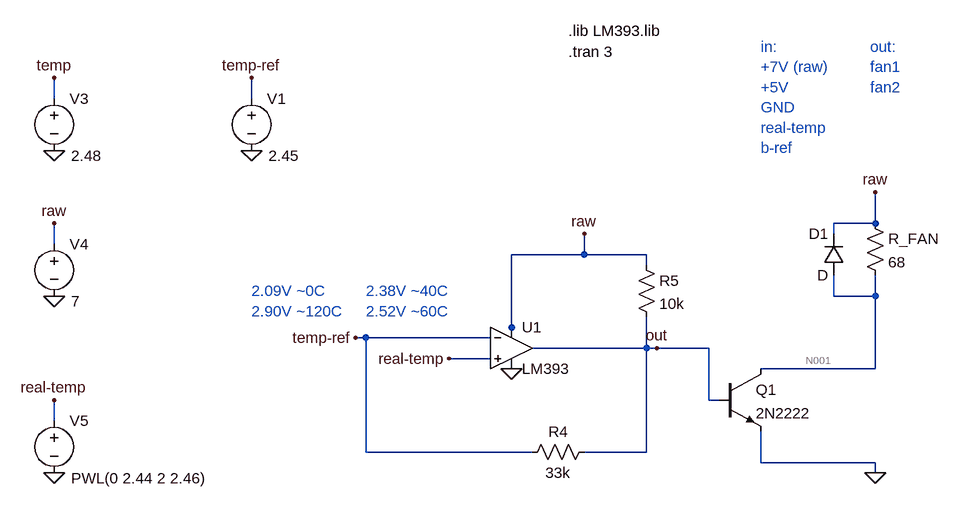
[diagram p0: schematic fan3.asc]
fan3.asc, the LTspice schematic file:
Version 4
SHEET 1 880 680
WIRE -608 -288 -608 -320
WIRE -304 -288 -304 -320
WIRE 656 -96 656 -144
WIRE 656 -96 592 -96
WIRE 592 -80 592 -96
WIRE -608 -64 -608 -96
WIRE 208 -48 208 -80
WIRE 208 -48 96 -48
WIRE 304 -48 208 -48
WIRE 304 -32 304 -48
WIRE 592 16 592 -16
WIRE 656 16 656 -16
WIRE 656 16 592 16
WIRE 96 64 96 -48
WIRE -128 80 -144 80
WIRE 64 80 -128 80
WIRE 96 80 96 64
WIRE 304 96 304 48
WIRE 304 96 128 96
WIRE 320 96 304 96
WIRE 400 96 320 96
WIRE 64 112 0 112
WIRE 656 128 656 16
WIRE 656 128 480 128
WIRE 400 176 400 96
WIRE 416 176 400 176
WIRE -608 208 -608 176
WIRE -128 256 -128 80
WIRE 128 256 -128 256
WIRE 304 256 304 96
WIRE 304 256 208 256
WIRE 480 272 480 224
WIRE 656 272 480 272
WIRE 656 288 656 272
FLAG 96 128 0
FLAG -304 -208 0
FLAG -304 -320 temp-ref
FLAG -144 80 temp-ref
FLAG 656 288 0
FLAG 656 -144 raw
FLAG -608 -208 0
FLAG -608 -320 temp
FLAG -608 16 0
FLAG -608 -96 raw
FLAG -608 288 0
FLAG -608 176 real-temp
FLAG 320 96 out
FLAG 208 -80 raw
FLAG 0 112 real-temp
SYMBOL OpAmps\\opamp2 96 32 R0
SYMATTR InstName U1
SYMATTR Value LM393
SYMBOL res 224 240 R90
WINDOW 0 0 56 VBottom 2
WINDOW 3 32 56 VTop 2
SYMATTR InstName R4
SYMATTR Value 33k
SYMBOL voltage -304 -304 R0
WINDOW 3 26 104 Left 2
WINDOW 123 0 0 Left 0
WINDOW 39 0 0 Left 0
SYMATTR Value 2.45
SYMATTR InstName V1
SYMBOL res 288 -48 R0
SYMATTR InstName R5
SYMATTR Value 10k
SYMBOL res 640 -112 R0
SYMATTR InstName R_FAN
SYMATTR Value 68
SYMBOL diode 608 -16 R180
WINDOW 0 24 64 Left 2
WINDOW 3 24 0 Left 2
SYMATTR InstName D1
SYMBOL voltage -608 -304 R0
WINDOW 3 26 104 Left 2
WINDOW 123 0 0 Left 0
WINDOW 39 0 0 Left 0
SYMATTR Value 2.48
SYMATTR InstName V3
SYMBOL voltage -608 -80 R0
WINDOW 3 26 104 Left 2
WINDOW 123 0 0 Left 0
WINDOW 39 0 0 Left 0
SYMATTR Value 7
SYMATTR InstName V4
SYMBOL voltage -608 192 R0
WINDOW 3 26 104 Left 2
WINDOW 123 0 0 Left 0
WINDOW 39 0 0 Left 0
SYMATTR Value PWL(0 2.44 2 2.46)
SYMATTR InstName V5
SYMBOL npn 416 128 R0
SYMATTR InstName Q1
SYMATTR Value 2N2222
TEXT 184 -360 Left 2 !.tran 3
TEXT 184 -392 Left 2 !.lib LM393.lib
TEXT -304 8 Left 2 ;2.09V ~0C\n2.90V ~120C
TEXT -128 8 Left 2 ;2.38V ~40C\n2.52V ~60C
TEXT 480 -368 Left 2 ;in:\n+7V (raw)\n+5V\nGND\nreal-temp\nb-ref
TEXT 648 -368 Left 2 ;out:\nfan1\nfan2

The netlist it stands for:
* fan3.asc
XU1 real-temp temp-ref raw 0 out LM393  ; pins In+ In- V+ V- OUT
R4 out temp-ref 33k
V1 temp-ref 0 2.45
R5 raw out 10k
R_FAN raw N001 68
D1 N001 raw D
V3 temp 0 2.48
V4 raw 0 7
V5 real-temp 0 PWL(0 2.44 2 2.46)
Q1 N001 out 0 0 2N2222
.model D D
.lib standard.dio
.model NPN NPN
.model PNP PNP
.lib standard.bjt
.tran 3
.lib LM393.lib
* 2.09V ~0C
* 2.90V ~120C
* 2.38V ~40C
* 2.52V ~60C
* in:
* +7V (raw)
* +5V
* GND
* real-temp
* b-ref
* out:
* fan1
* fan2
.backanno
.end

* Results of the author's LTspice run, read from the files saved beside the schematic
* Operating Point, zero values left out:
*   V(raw) = 7 V
*   V(real-temp) = 2.44 V
*   V(temp-ref) = 2.45 V
*   V(out) = 96.57 mV
*   V(n001) = 7 V
*   V(temp) = 2.48 V
*   Ic(Q1) = 7.354 pA
*   Ib(Q1) = -6.808 pA
*   I(R4) = -71.32 µA
*   I(R5) = 690.3 µA
*   I(R_fan) = 7.354 pA
*   I(V1) = -71.3 µA
*   I(V4) = -922.4 µA
*   I(V5) = 29.76 nA
*   Ix(u1:1) = -29.76 nA
*   Ix(u1:2) = -20.21 nA
*   Ix(u1:3) = 232 µA
*   Ix(u1:4) = -993.6 µA
*   Ix(u1:5) = 761.7 µA
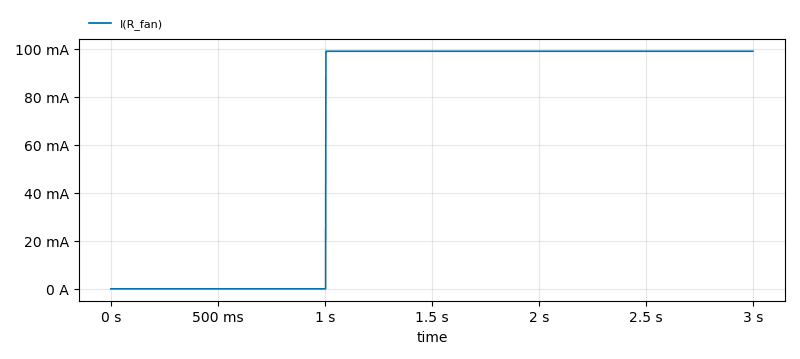
[diagram p1: Transient Analysis of fan3.asc, plotted from the saved traces]
* Transient Analysis, 1 run:
*   I(R_fan): min 0 A, max 98.88 mA, average 65.78 mA, rms 80.64 mA, last 98.88 mA